# EasyEDA Pro project RAM.eprj, board PCB1
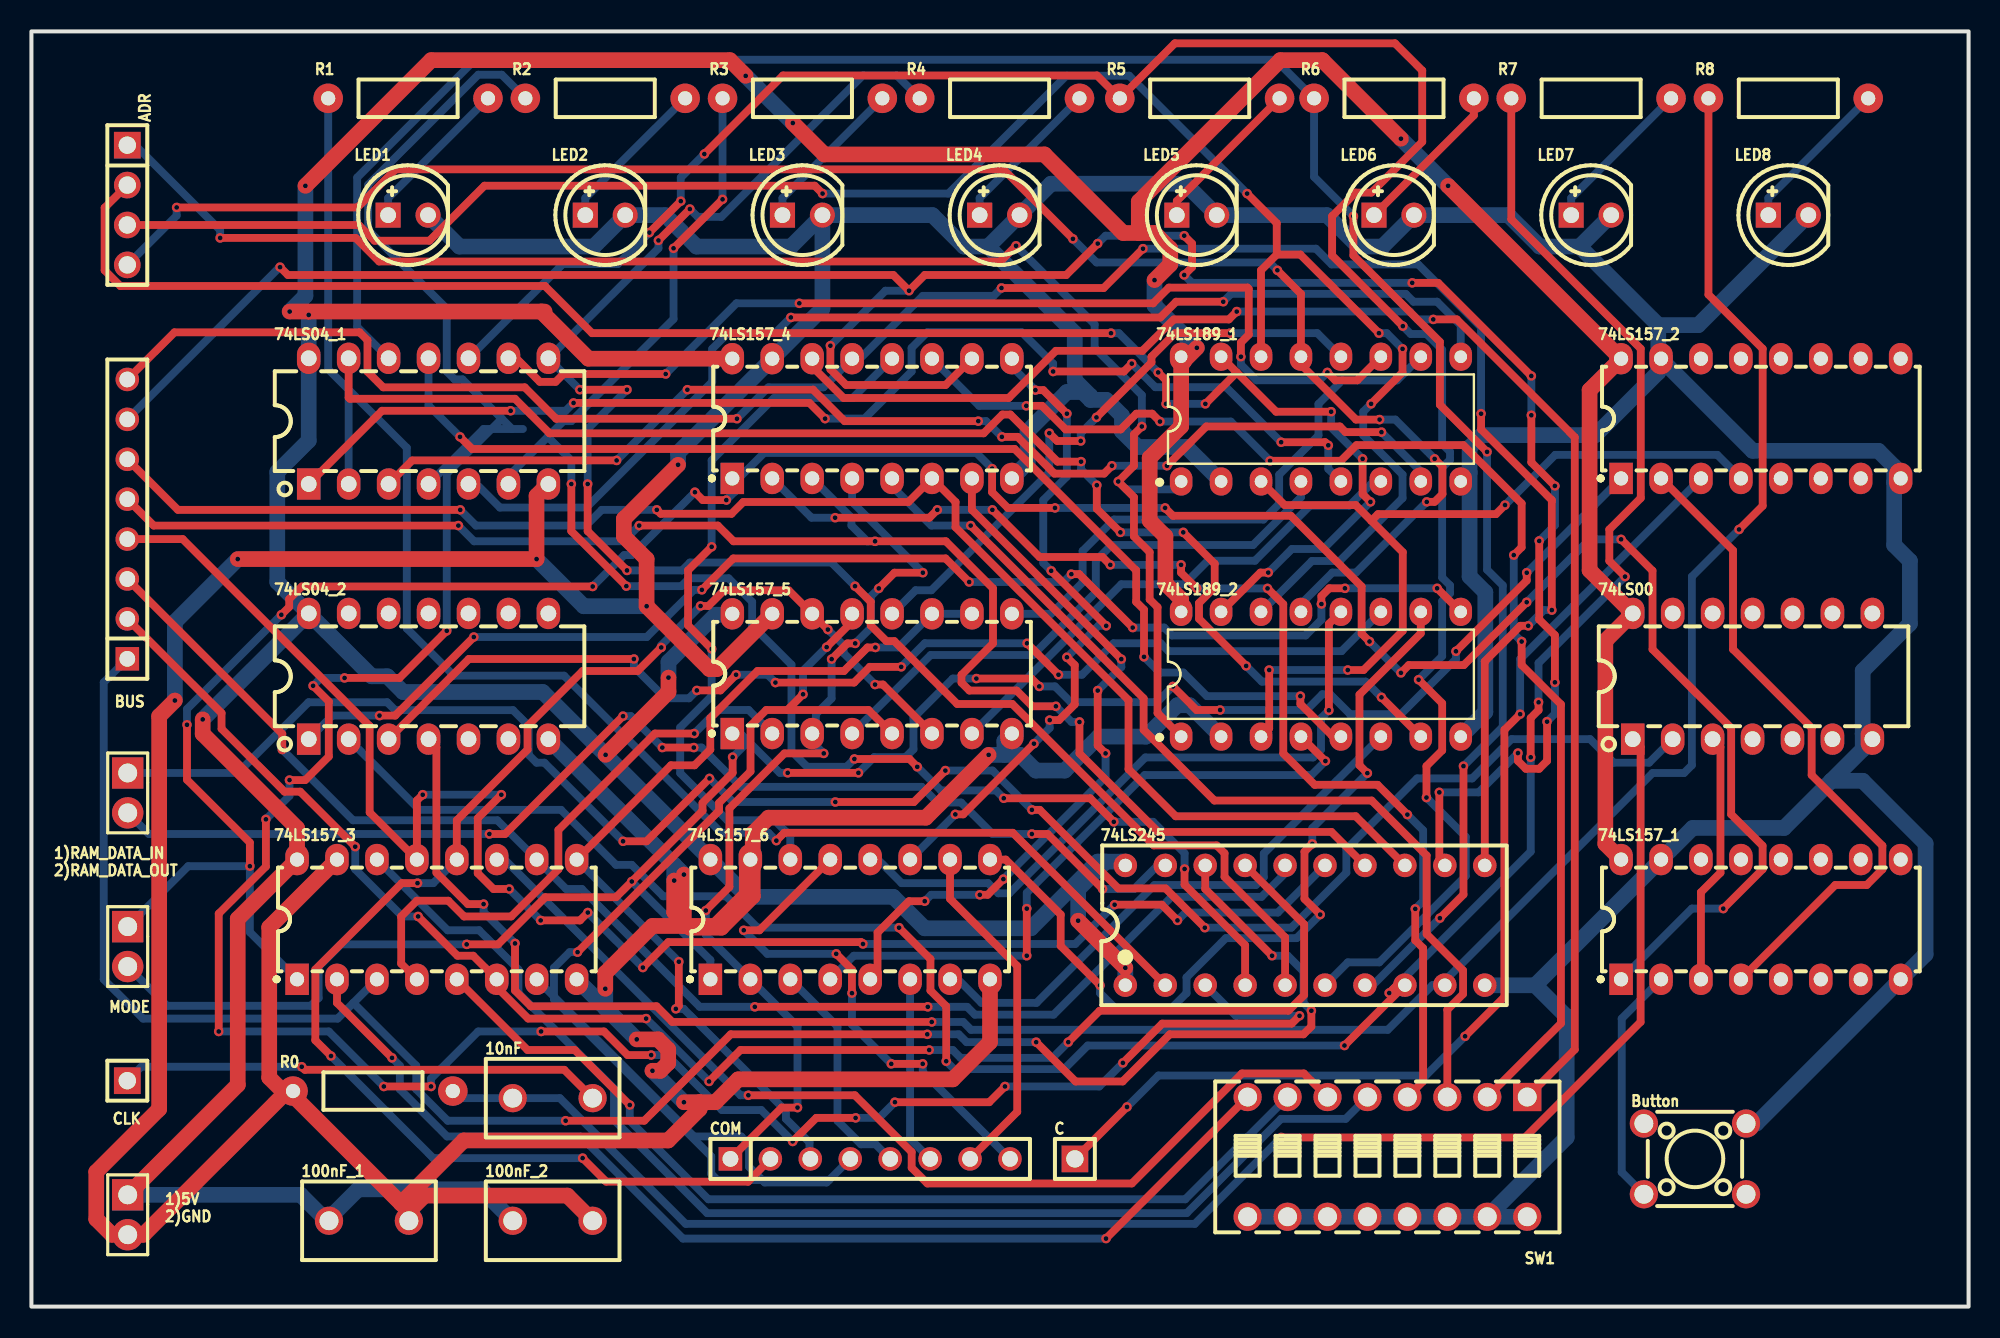
[diagram p1: board, top side]
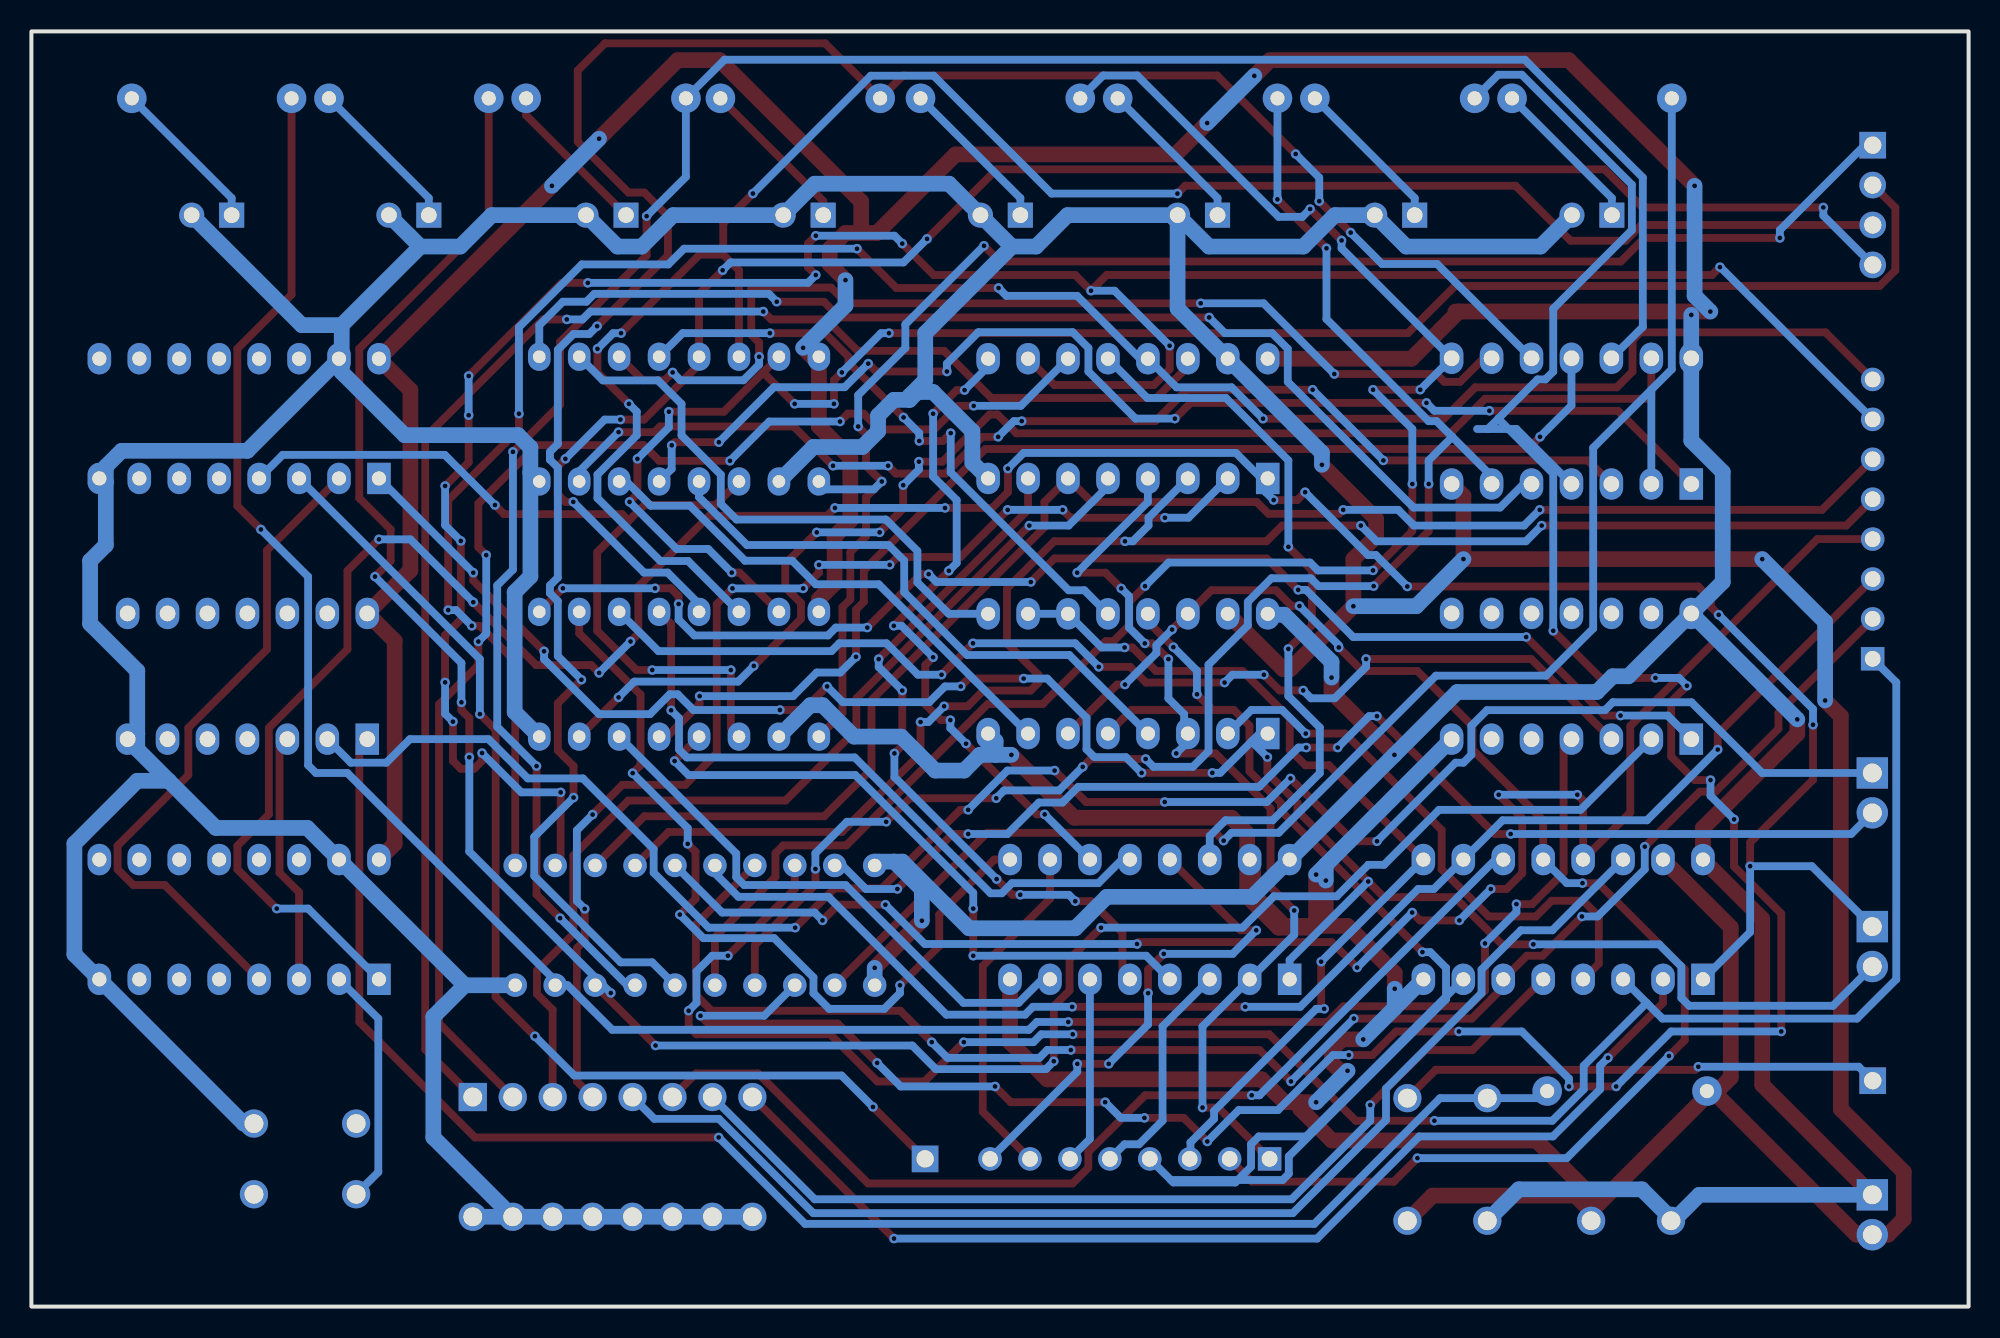
[diagram p2: board, bottom side, seen from below]

Outline 123.19 x 81.15 mm; copper layers: Top Layer, Bottom Layer. Coordinates in mm from the lower left corner of the outline.
Outline path: rectangle 0,81.15 123.19,0
Stack: Top Layer 0.035mm / Dielectric1 1.51mm FR4 er 4.5 / Bottom Layer 0.035mm

## Design rules (mm)
template: Custom Config
spacing copperThickness1oz (default): track to track 0.102, other pairs 0.152 to 0.3
spacing copperThickness2oz: track to track 0.203, other pairs 0.152 to 0.3
track width copperThickness1oz (default): min 0.127, default 0.5, max 2.54
track width copperThickness2oz: min 0.203, default 1, max 2.54
differential pair differentialPair (default): width min 0.127, default 0.254, max 2.54; gap min 0.152, default 0.152
via viaSize (default): diameter min 0.5, default 0.61, max 10; hole min 0.3, default 0.305, max 6.3
net +5V uses copperThickness2oz
net GND uses copperThickness2oz

## Placement (name value [footprint] x y rotation side)
1)5V
2)GND  -  [HDR-TH_2P-P2.54-V-M]  6.12 5.84 270 top
1)RAM_DATA_IN
2)RAM_DATA_OUT  -  [HDR-TH_2P-P2.54-V-M]  6.12 32.69 270 top
10nF  -  [CAP-TH_L8.5-W5.0-P5.00-D1.2]  33.15 13.26 0 top
74LS00  SN74LS00N  [PDIP-14_L19.7-W6.6-P2.54-LS8.3-BL]  109.45 40.11 0 top
74LS04_1  SN74LS04N  [PDIP-14_L19.7-W6.6-P2.54-LS8.3-BL]  25.25 56.35 0 top
74LS04_2  SN74LS04N  [PDIP-14_L19.7-W6.6-P2.54-LS8.3-BL]  25.25 40.11 0 top
74LS157_1  SN74LS157N  [DIP-16_16P-L20.2-W6.6-P2.54-LS7.6-BL]  109.98 24.64 0 top
74LS157_2  SN74LS157N  [DIP-16_16P-L20.2-W6.6-P2.54-LS7.6-BL]  109.98 56.52 0 top
74LS157_3  SN74LS157N  [DIP-16_16P-L20.2-W6.6-P2.54-LS7.6-BL]  25.78 24.64 0 top
74LS157_4  SN74LS157N  [DIP-16_16P-L20.2-W6.6-P2.54-LS7.6-BL]  53.46 56.52 0 top
74LS157_5  SN74LS157N  [DIP-16_16P-L20.2-W6.6-P2.54-LS7.6-BL]  53.46 40.28 0 top
74LS157_6  SN74LS157N  [DIP-16_16P-L20.2-W6.6-P2.54-LS7.6-BL]  52.07 24.64 0 top
74LS189_1  74LS189  [PDIP-16_L19.3-W6.4-P2.54-LS7.94-BL]  82 56.48 0 top
74LS189_2  74LS189  [PDIP-16_L19.3-W6.4-P2.54-LS7.94-BL]  82 40.24 0 top
74LS245  SN74LS245N  [DIP-20_L25.5-W10.0-P2.54-LS7.6-BL]  80.99 24.27 0 top
100nF_1  -  [CAP-TH_L8.5-W5.0-P5.00-D1.2]  21.46 5.46 0 top
100nF_2  -  [CAP-TH_L8.5-W5.0-P5.00-D1.2]  33.15 5.46 0 top
ADR  PZ254V-11-04P  [HDR-TH_4P-P2.54-V-M]  6.1 70.1 270 top
BUS  PZ254V-11-08P  [HDR-TH_8P-P2.54-V-M]  6.1 50.11 90 top
Button  -  [SW-TH_4P-L6.0-W6.0-P4.50-LS6.5]  105.79 9.4 0 top
C  PZ254V-11-01P  [HDR-TH_1P-P2.54-V-M]  66.36 9.4 0 top
CLK  -  [HDR-TH_1P-P2.54-V-M]  6.1 14.38 0 top
COM  PZ254V-11-08P  [HDR-TH_8P-P2.54-V-M]  53.34 9.4 0 top
LED1  -  [LED-TH_BD5.8-P2.54-FD]  23.95 69.46 0 top
LED2  -  [LED-TH_BD5.8-P2.54-FD]  36.49 69.46 0 top
LED3  -  [LED-TH_BD5.8-P2.54-FD]  49.03 69.46 0 top
LED4  -  [LED-TH_BD5.8-P2.54-FD]  61.57 69.46 0 top
LED5  -  [LED-TH_BD5.8-P2.54-FD]  74.11 69.46 0 top
LED6  -  [LED-TH_BD5.8-P2.54-FD]  86.65 69.46 0 top
LED7  -  [LED-TH_BD5.8-P2.54-FD]  99.19 69.46 0 top
LED8  -  [LED-TH_BD5.8-P2.54-FD]  111.73 69.46 0 top
MODE  PZ254V-11-02P  [HDR-TH_2P-P2.54-V-M]  6.12 22.91 270 top
R0  1K  [R_AXIAL-0.4]  21.72 13.72 0 top
R1  220  [R_AXIAL-0.4]  23.95 76.9 0 top
R2  220  [R_AXIAL-0.4]  36.49 76.9 0 top
R3  220  [R_AXIAL-0.4]  49.03 76.9 0 top
R4  220  [R_AXIAL-0.4]  61.57 76.9 0 top
R5  220  [R_AXIAL-0.4]  74.3 76.9 0 top
R6  220  [R_AXIAL-0.4]  86.65 76.9 0 top
R7  220  [R_AXIAL-0.4]  99.19 76.9 0 top
R8  220  [R_AXIAL-0.4]  111.73 76.9 0 top
SW1  DSWB08LHGET  [SW-TH_DSWB08LHGET]  86.23 9.53 180 top

## Footprints (pads in the part's own frame, mm; a bottom-side part is the same pattern mirrored in y, then rotated)
CAP-TH_L8.5-W5.0-P5.00-D1.2
  round 1.8 hole 1.2: 1(-2.54,0) 2(2.54,0)
DIP-16_16P-L20.2-W6.6-P2.54-LS7.6-BL
  rect 1.5x2 hole 0.9: 1(-8.89,-3.81)
  oval 1.5x2 hole 0.9: 2(-6.35,-3.81) 3(-3.81,-3.81) 4(-1.27,-3.81) 5(1.27,-3.81) 6(3.81,-3.81) 7(6.35,-3.81) 8(8.89,-3.81) 9(8.89,3.81) 10(6.35,3.81) 11(3.81,3.81) 12(1.27,3.81) 13(-1.27,3.81) 14(-3.81,3.81) 15(-6.35,3.81) 16(-8.89,3.81)
DIP-20_L25.5-W10.0-P2.54-LS7.6-BL
  round 1.5 hole 0.85: 1(-11.43,-3.81) 2(-8.89,-3.81) 3(-6.35,-3.81) 4(-3.81,-3.81) 5(-1.27,-3.81) 6(1.27,-3.81) 7(3.81,-3.81) 8(6.35,-3.81) 9(8.89,-3.81) 10(11.43,-3.81) 11(11.43,3.81) 12(8.89,3.81) 13(6.35,3.81) 14(3.81,3.81) 15(1.27,3.81) 16(-1.27,3.81) 17(-3.81,3.81) 18(-6.35,3.81) 19(-8.89,3.81) 20(-11.43,3.81)
HDR-TH_1P-P2.54-V-M
  rect 1.7x1.7 hole 1.1: 1(0,0)
HDR-TH_2P-P2.54-V-M
  rect 2x2 hole 1.2: 1(-1.27,0)
  round 2 hole 1.2: 2(1.27,0)
HDR-TH_4P-P2.54-V-M
  rect 1.7x1.7 hole 1.1: 1(-3.81,0)
  round 1.7 hole 1.1: 2(-1.27,0) 3(1.27,0) 4(3.81,0)
HDR-TH_8P-P2.54-V-M
  rect 1.5x1.5 hole 1: 1(-8.89,0)
  round 1.5 hole 1: 2(-6.35,0) 3(-3.81,0) 4(-1.27,0) 5(1.27,0) 6(3.81,0) 7(6.35,0) 8(8.89,0)
LED-TH_BD5.8-P2.54-FD
  rect 1.6x1.6 hole 1: 1(-1.27,0)
  round 1.6 hole 1: 2(1.27,0)
PDIP-14_L19.7-W6.6-P2.54-LS8.3-BL
  rect 1.5x2 hole 1: 1(-7.62,-4)
  oval 1.5x2 hole 1: 2(-5.08,-4) 3(-2.54,-4) 4(0,-4) 5(2.54,-4) 6(5.08,-4) 7(7.62,-4) 8(7.62,4) 9(5.08,4) 10(2.54,4) 11(0,4) 12(-2.54,4) 13(-5.08,4) 14(-7.62,4)
PDIP-16_L19.3-W6.4-P2.54-LS7.94-BL
  oval 1.44x1.8 hole 0.8: 1(-8.89,-3.97) 2(-6.35,-3.97) 3(-3.81,-3.97) 4(-1.27,-3.97) 5(1.27,-3.97) 6(3.81,-3.97) 7(6.35,-3.97) 8(8.89,-3.97) 9(8.89,3.97) 10(6.35,3.97) 11(3.81,3.97) 12(1.27,3.97) 13(-1.27,3.97) 14(-3.81,3.97) 15(-6.35,3.97) 16(-8.89,3.97)
R_AXIAL-0.4
  round 1.879 hole 0.899: 1(-5.08,0) 2(5.08,0)
SW-TH_4P-L6.0-W6.0-P4.50-LS6.5
  round 1.8 hole 1.2: 1(-3.25,2.25) 2(3.25,2.25) 3(-3.25,-2.25) 4(3.25,-2.25)
SW-TH_DSWB08LHGET
  rect 1.8x1.8 hole 1.2: 1(-8.89,-3.81)
  round 1.8 hole 1.2: 2(-6.35,-3.81) 3(-3.81,-3.81) 4(-1.27,-3.81) 5(1.27,-3.81) 6(3.81,-3.81) 7(6.35,-3.81) 8(8.89,-3.81) 9(-8.89,3.81) 10(-6.35,3.81) 11(-3.81,3.81) 12(-1.27,3.81) 13(1.27,3.81) 14(3.81,3.81) 15(6.35,3.81) 16(8.89,3.81)

## Nets
As in the schematic, except:
+5V: 1)5V
2)GND.1 74LS00.14 74LS04_1.14 74LS04_2.14 74LS157_1.16 74LS157_2.16 74LS157_3.16 74LS157_4.16 74LS157_5.16 74LS157_6.16 74LS189_1.16 74LS189_2.16 74LS245.1 74LS245.20 100nF_1.1 100nF_2.1
GND: 1)5V
2)GND.2 74LS00.7 74LS04_1.7 74LS04_2.7 74LS157_1.8 74LS157_1.15 74LS157_2.8 74LS157_2.15 74LS157_3.8 74LS157_3.15 74LS157_4.8 74LS157_4.15 74LS157_5.8 74LS157_5.15 74LS157_6.8 74LS157_6.15 74LS189_1.2 74LS189_1.8 74LS189_2.2 74LS189_2.8 74LS245.10 100nF_1.2 100nF_2.2 Button.2 LED1.2 LED2.2 LED3.2 LED4.2 LED5.2 LED6.2 LED7.2 LED8.2 R0.1 SW1.9 SW1.10 SW1.11 SW1.12 SW1.13 SW1.14 SW1.15 SW1.16
CLK: 10nF.2 CLK.1
RAM_DATA_IN: 1)RAM_DATA_IN
2)RAM_DATA_OUT.1 74LS00.2
RAM_DATA_OUT: 1)RAM_DATA_IN
2)RAM_DATA_OUT.2 74LS245.19
$1N2052: 10nF.1 74LS00.1 R0.2

Pads without a net: 74LS00 4 5 6 8 9 10 11 12 13; 74LS04_2 5 6 8 9 10 11 12 13; 74LS157_1 5 6 7 9 10 11 12 13 14; 74LS157_2 5 6 7 9 10 11 12 13 14; Button 1 4

## Via types
v1: diameter 0.61, hole 0.305, Top Layer to Bottom Layer, 319 vias

## Routing (per net, layer and track width the routed paths; a pad name or vN(x,y) marks a point on that pad's centre or on a via; arc(x,y) is an arc through that point)
+5V: length 386.9
  Top Layer w1: v1(71.42,65.33) 72.42,66.33 72.42,67.33 71.42,68.33 70.42,68.33 ; 73.11,60.02 73.11,56.02 71.11,54.02 71.11,50.02 72.11,49.02 72.11,46.02 73.11,45.02 74LS189_2.16 ; 73.11,60.02 74LS189_1.16 ; 73.11,60.02 v1(74.11,61.02) ; v1(48.42,75.33) 50.42,73.33 64.42,73.33 69.42,68.33 70.42,68.33 ; 70.42,68.33 70.42,70.33 79.42,79.33 82.09,79.33 v1(87.09,74.33) ; 74LS157_4.16 35.42,60.33 32.42,63.33 ; 101.09,28.45 100.09,29.45 100.09,42.37 74LS00.14 99.09,46.86 99.09,58.33 101.09,60.33 v1(90.09,71.33) ; 1)5V
2)GND.1 13.12,14.11 13.12,24.68 74LS157_3.16 16.89,30.45 10.89,36.45 v1(10.89,37.37) ; 32.42,63.33 32.63,63.33 ; 32.42,63.33 v1(16.42,63.33) ; v1(17.42,71.33) 25.42,79.33 44.42,79.33 v1(45.42,78.33) ; v1(36.51,35.11) 40.51,39.11 v1(40.51,40.03) ; v1(66.56,24.56) v1(69.56,21.56)
  Bottom Layer w1: 74LS245.20 69.32,28.32 68.32,28.32 ; v1(74.11,61.02) 71.42,63.71 v1(71.42,65.33) ; v1(17.42,71.33) 17.42,64.33 v1(16.42,63.33) ; v1(45.42,78.33) v1(48.42,75.33) ; v1(10.89,37.37) 74LS04_2.14 ; 74LS04_2.14 21.63,40.11 22.63,40.11 23.63,39.11 32.51,39.11 v1(36.51,35.11) 74LS157_6.16 45.55,26.08 54.81,26.08 56.81,24.08 63.56,24.08 67.81,28.32 68.32,28.32 ; 74LS04_2.14 15.63,46.11 15.63,53.11 17.63,55.11 74LS04_1.14 v1(17.63,63.11) ; 18.77,5.46 20.77,7.46 28.61,7.46 100nF_2.1 ; 18.77,5.46 17.12,7.11 1)5V
2)GND.1 ; 18.77,5.46 100nF_1.1 ; 68.32,28.32 66.56,26.56 v1(66.56,24.56) ; 74LS157_5.16 44.51,44.03 43.51,44.03 40.51,41.03 v1(40.51,40.03) ; v1(87.09,74.33) v1(90.09,71.33) ; v1(69.56,21.56) 74LS245.1
GND: length 627.3
  Top Layer w1: 41.49,24.22 39.49,24.22 36.49,21.22 v1(36.49,20.22) ; 41.49,24.22 41.49,24.49 ; 41.49,24.22 41.76,24.22 ; 16.49,13.57 23.49,6.57 ; 16.49,13.57 16.12,13.57 ; 16.49,13.57 R0.1 ; 23.49,6.57 24,6.06 ; 23.49,6.57 27.49,10.57 40.49,10.57 42.49,12.57 42.49,13.01 ; v1(39.49,15.01) 39.99,15.01 40.49,15.51 40.49,16.36 39.85,17.01 v1(38.49,17.01) ; 42.49,13.01 43.49,13.01 44.95,14.46 58.59,14.46 60.96,16.83 74LS157_6.8 ; 42.49,13.01 v1(41.49,13.01) ; 74LS157_5.15 43.59,40.57 43.12,40.57 v1(39.12,44.57) 39.12,47.57 37.68,49.02 37.68,50.13 v1(41.12,53.57) ; v1(13.12,47.57) v1(32.12,47.57) 32.12,51.6 74LS04_1.7 ; 16.12,13.57 7.12,4.57 1)5V
2)GND.2 5.12,4.57 4.12,5.57 4.12,8.57 8.12,12.57 8.12,37.57 v1(9.12,38.57) ; 16.12,13.57 15.12,14.57 15.12,24.14 74LS157_3.15 ; 24,6.06 100nF_1.2 ; 24,6.06 25,7.06 34.09,7.06 100nF_2.2 ; 41.49,24.49 v1(41.49,27.49) ; 41.49,24.49 41.76,24.22 ; 41.49,24.49 40.87,25.11 v1(40.87,27.11) ; 41.76,24.22 41.87,24.11 43.87,24.11 45.87,26.11 45.87,30.11 46.87,31.11 56.87,31.11 v1(60.87,35.11) ; 41.76,24.22 43.49,24.22 45.49,26.22 45.49,28.22 74LS157_6.15
  Bottom Layer w1: 74LS189_1.2 73.46,54.7 70.35,54.7 69.35,55.7 69.35,56.7 68.35,57.7 67.35,57.7 ; LED3.2 48.3,67.46 42.3,67.46 40.3,69.46 LED2.2 35.76,67.46 27.22,67.46 LED1.2 ; LED3.2 57.3,69.46 59.3,67.46 60.84,67.46 ; LED3.2 50.3,63.52 74LS157_4.15 41.12,54.34 v1(41.12,53.57) ; 60.84,67.46 66.35,61.95 66.35,58.95 67.35,57.95 67.35,57.7 ; 60.84,67.46 64.84,71.46 73.38,71.46 LED5.2 82.38,69.46 84.38,67.46 85.92,67.46 LED6.2 93.92,69.46 95.92,67.46 98.46,67.46 ; 91.46,53.08 74LS189_1.8 ; 91.46,53.08 91.46,46.46 92.46,45.46 92.46,37.84 74LS189_2.8 ; 91.46,53.08 91.46,54.68 92.24,55.46 99.46,55.46 103.46,59.46 103.46,60.46 ; 67.35,57.7 66.85,58.2 65.85,58.2 63.35,55.7 63.35,53.7 74LS157_4.8 ; 40.87,28.11 74LS04_2.7 ; 40.87,28.11 v1(41.49,27.49) ; 40.87,28.11 v1(40.87,27.11) ; 103.46,60.46 109.46,54.46 117.46,54.46 118.46,53.46 118.46,52.46 ; 103.46,60.46 103.63,60.33 ; 103.46,60.46 103.46,62.46 ; 98.46,67.46 103.46,62.46 ; 98.46,67.46 LED7.2 ; 114.46,33.46 116.46,35.46 116.46,36.46 ; 114.46,33.46 111.46,30.46 105.64,30.46 95.63,20.45 ; 114.46,33.46 116.46,33.46 120.46,29.46 120.46,22.42 74LS157_1.8 109.69,11.65 Button.2 ; 74LS189_2.2 73.65,38.27 72.87,38.27 70.87,36.27 67.87,36.27 65.71,34.11 63.87,34.11 62.87,35.11 61.87,35.11 ; v1(41.49,13.01) v1(39.49,15.01) ; SW1.16 SW1.15 SW1.14 SW1.13 SW1.12 SW1.11 SW1.10 ; 74LS157_5.8 61.87,35.99 61.87,35.11 ; v1(32.12,47.57) 35.12,44.57 v1(39.12,44.57) ; 116.46,36.46 116.73,36.46 74LS00.7 ; 116.46,36.46 116.46,40.46 119.46,43.46 119.46,47.46 118.46,48.46 118.46,52.46 ; 118.46,52.46 118.63,52.46 74LS157_2.8 ; v1(38.49,17.01) 36.49,19.01 ; 36.49,19.01 74LS157_3.8 ; 36.49,19.01 v1(36.49,20.22) ; 95.63,20.45 92.43,20.45 74LS245.10 ; 95.63,20.45 97.63,18.45 97.63,10.76 SW1.10 ; v1(9.12,38.57) 9.12,43.57 v1(13.12,47.57) ; 103.46,62.46 106,62.46 LED8.2 ; SW1.10 SW1.9 ; v1(60.87,35.11) 61.87,35.11
A0: length 101.5
  Top Layer w0.5: v1(12,68.01) 20.61,68.01 22.11,66.51 61.61,66.51 v1(62.61,67.51) ; 74LS189_2.1 71.61,37.77 71.61,44.51 71.11,45.01 71.11,48.01 70.11,49.01 70.11,51.51 v1(69.11,52.51) 70.11,53.51 70.11,55.51 v1(70.61,56.01)
  Bottom Layer w0.5: 74LS189_1.1 72.61,52.01 69.61,52.01 v1(69.11,52.51) ; v1(70.61,56.01) 70.61,58.01 67.61,61.01 67.61,62.51 v1(62.61,67.51) ; ADR.1 6.6,73.91 12,68.51 v1(12,68.01)
A1: length 110.9
  Top Layer w0.5: 74LS189_1.15 76.65,59.45 ; 76.65,59.45 v1(74.65,57.45) ; 76.65,59.45 79.15,56.95 v1(82.65,56.95) ; 74LS189_2.15 78.15,46.71 v1(78.65,46.71) ; ADR.2 4.65,69.93 4.65,65.95 5.65,64.95 32.65,64.95 35.65,61.95 v1(68.65,61.95) ; v1(84.65,53.95) 84.65,51.71 v1(85.15,51.21) ; v1(71.65,59.45) 72.15,58.95 v1(72.15,57.45)
  Bottom Layer w0.5: v1(74.65,57.45) v1(72.15,57.45) ; v1(71.65,59.45) 69.15,61.95 v1(68.65,61.95) ; v1(78.65,46.71) 80.15,48.21 82.15,48.21 v1(85.15,51.21) ; v1(82.65,56.95) 82.65,55.95 v1(84.65,53.95)
A2: length 125.1
  Top Layer w0.5: 74LS189_1.14 78.19,65.95 79.19,66.95 ; v1(85.69,61.95) 80.69,66.95 79.19,66.95 ; 79.19,66.95 79.19,68.95 v1(77.31,70.83) ; ADR.3 20.81,68.83 21.81,67.83 25.31,67.83 28.81,71.33 49.81,71.33 v1(50.31,70.83) ; v1(87.19,60.95) 87.19,59.45 v1(85.19,57.45)
  Bottom Layer w0.5: v1(85.69,61.95) 86.19,61.95 v1(87.19,60.95) ; v1(50.31,70.83) 58.31,70.83 65.81,78.33 69.81,78.33 v1(77.31,70.83) ; v1(85.19,57.45) 84.69,56.95 84.69,55.45 87.19,52.95 87.19,51.45 83.19,47.45 81.43,47.45 74LS189_2.14
A3: length 111.1
  Top Layer w0.5: v1(89.23,53.95) 89.73,53.45 89.73,51.71 89.23,51.21 v1(88.73,51.21) ; v1(66.23,67.95) 61.81,72.37 23.16,72.37 20.73,69.95 v1(9.23,69.95) ; v1(79.23,65.95) 80.73,64.45 74LS189_1.13 80.73,59.95 84.23,56.45 v1(85.73,56.45)
  Bottom Layer w0.5: 74LS189_2.13 80.73,44.71 82.73,46.71 84.23,46.71 v1(88.73,51.21) ; v1(89.23,53.95) 86.73,56.45 v1(85.73,56.45) ; v1(79.23,65.95) 78.73,66.45 67.73,66.45 v1(66.23,67.95) ; v1(9.23,69.95) 9.23,69.43 ADR.4
BUS_1: length 124
  Top Layer w0.5: v1(56.97,17.33) 44.47,17.33 38.97,11.83 v1(33.97,11.83) ; v1(63.9,16.83) 66.4,14.33 69.4,14.33 72.4,17.33 80.9,17.33 81.4,17.83 v1(81.4,18.83) ; v1(78.9,22.33) 74.64,26.58 74LS245.18
  Bottom Layer w0.5: BUS.1 4.6,39.72 4.6,20.83 7.1,18.33 19.47,18.33 20.47,19.33 ; v1(78.9,22.33) 79.9,22.33 80.9,21.33 80.9,19.33 v1(81.4,18.83) ; v1(63.9,16.83) 59.47,16.83 58.97,17.33 v1(56.97,17.33) ; v1(33.97,11.83) 26.47,11.83 24.47,13.83 24.47,15.33 20.47,19.33 ; 20.47,19.33 74LS157_3.3
BUS_2: length 101.3
  Top Layer w0.5: v1(20.59,29.27) 17.09,32.77 16.09,32.77 12.09,36.77 12.09,37.77 BUS.2 ; v1(39.09,18.33) 31.59,18.33 29.59,20.33 74LS157_3.6 28.09,22.33 27.09,22.33 v1(24.59,24.83) ; v1(57.09,16.33) 45.09,16.33 v1(43.09,14.33) ; 74LS245.17 80.94,24.33 80.94,19.83 79.94,18.83 67.94,18.83 v1(65.94,16.83)
  Bottom Layer w0.5: v1(24.59,24.83) 23.59,24.83 20.59,27.83 v1(20.59,29.27) ; v1(39.09,18.33) v1(43.09,14.33) ; v1(57.09,16.33) 58.59,16.33 59.09,15.83 64.94,15.83 v1(65.94,16.83)
BUS_3: length 89.9
  Top Layer w0.5: BUS.3 15.95,36.45 v1(15.95,35.45) ; v1(46,19.08) v1(57,19.08)
  Bottom Layer w0.5: 74LS245.16 79.72,27.58 78.22,26.08 72.5,26.08 65,18.58 60,18.58 59.5,19.08 v1(57,19.08) ; v1(46,19.08) 42.5,19.08 35,26.58 34,26.58 74LS157_3.10 29.63,30.95 20.45,30.95 v1(15.95,35.45)
BUS_4: length 105.4
  Top Layer w0.5: v1(38.88,21.58) 40.5,23.2 52.76,23.2 v1(52.88,23.08) ; v1(72.88,24.58) 71.88,25.58 v1(68.88,25.58) ; v1(32.38,24.58) 34.88,24.58 v1(35.38,25.08) ; v1(29.88,32.58) 28.38,31.08 28.38,27.58 29.38,26.58 v1(30.38,26.58) ; BUS.4 9.62,48.84 21.51,36.95 21.51,31.45 74LS157_3.13 24.51,32.2 v1(24.88,32.58)
  Bottom Layer w0.5: v1(52.88,23.08) 66.38,23.08 v1(68.88,25.58) ; 74LS245.15 79.26,25.08 73.38,25.08 v1(72.88,24.58) ; v1(24.88,32.58) v1(29.88,32.58) ; v1(30.38,26.58) v1(32.38,24.58) ; v1(35.38,25.08) v1(38.88,21.58)
BUS_5: length 102.7
  Top Layer w0.5: BUS.5 7.78,49.7 v1(27.15,49.7) ; v1(65.15,38.2) 63.65,38.2 62.65,39.2 59.65,39.2 59.15,39.7 59.15,40.2 61.15,42.2 61.15,45.7 58.15,48.7 v1(53.65,48.7) 44.65,48.7 43.65,49.7 v1(38.65,49.7) ; v1(66.65,37.2) 66.65,35.2 71.65,30.2 82.68,30.2 74LS245.14
  Bottom Layer w0.5: v1(53.65,48.7) 53.15,48.7 52.15,49.7 52.15,50.2 74LS157_4.3 ; v1(27.15,49.7) 28.15,48.7 37.65,48.7 v1(38.65,49.7) ; v1(66.65,37.2) 66.15,37.2 v1(65.15,38.2)
BUS_6: length 98.2
  Top Layer w0.5: v1(39.77,50.7) 40.02,50.45 44.52,50.45 45.27,51.2 55.77,51.2 74LS157_4.6 58.77,51.2 58.77,49.6 69.77,38.6 69.77,34.2 72.77,31.2 84.22,31.2 74LS245.13 ; v1(27.27,50.7) 9.31,50.7 BUS.6
  Bottom Layer w0.5: v1(39.77,50.7) 36.27,50.7 35.27,49.7 28.27,49.7 v1(27.27,50.7)
BUS_7: length 158.8
  Top Layer w0.5: 74LS157_4.10 58.14,58.65 51.81,58.65 50.81,59.65 v1(50.81,61.15) ; v1(96.38,37.23) 96.38,34.73 95.88,34.23 95.03,34.23 94.53,34.73 v1(94.53,35.23) ; v1(95.38,56.73) 95.38,53.73 v1(96.88,52.23) ; v1(67.81,67.65) 65.81,65.65 56.81,65.65 v1(55.81,64.65) 54.81,65.65 16.31,65.65 v1(15.81,66.15) ; v1(87.81,65.15) 89.46,65.15 v1(95.38,59.23) ; v1(73.31,68.15) 73.81,67.65 73.81,66.15 v1(73.31,65.65) ; v1(96.88,39.73) 96.88,42.73 95.88,43.73 v1(95.88,48.73) ; v1(89.53,32.73) 89.53,28.43 74LS245.12
  Bottom Layer w0.5: v1(50.81,61.15) 54.31,64.65 v1(55.81,64.65) ; v1(87.81,65.15) 73.81,65.15 v1(73.31,65.65) ; v1(95.88,48.73) 96.88,49.73 v1(96.88,52.23) ; v1(96.88,39.73) 96.88,37.73 v1(96.38,37.23) ; v1(89.53,32.73) 92.03,32.73 v1(94.53,35.23) ; v1(67.81,67.65) 68.31,68.15 v1(73.31,68.15) ; v1(95.38,59.23) v1(95.38,56.73) ; v1(15.81,66.15) 15.78,66.15 BUS.7
BUS_8: length 135.8
  Top Layer w0.5: BUS.8 9.1,62 20.87,62 21.37,61.5 21.37,59.5 22.37,58.5 31.37,58.5 33.37,56.5 v1(44.87,56.5) ; 74LS245.11 92.42,41.06 94.69,43.33 v1(95.19,43.33) ; v1(61.69,64.83) 68.19,64.83 v1(70.69,67.33) ; v1(96.69,44.33) 96.69,51.33 92.19,55.83 v1(92.19,56.83)
  Bottom Layer w0.5: v1(95.19,43.33) 96.19,44.33 v1(96.69,44.33) ; v1(61.69,64.83) 61.19,64.33 56.69,64.33 52.69,60.33 74LS157_4.13 50.37,58.5 46.87,58.5 v1(44.87,56.5) ; v1(92.19,56.83) 92.19,62.33 88.19,66.33 82.69,66.33 81.69,67.33 v1(70.69,67.33)
C: length 69.8
  Top Layer w0.5: v1(69.67,12.71) C.1 ; v1(91.17,17.21) 93.67,19.71 93.67,36.7 v1(94.67,37.7)
  Bottom Layer w0.5: 74LS157_2.3 94.67,41.2 v1(94.67,37.7) ; v1(91.17,17.21) 88.67,14.71 71.67,14.71 v1(69.67,12.71)
C_1: length 59.2
  Top Layer w0.5: v1(52.39,42.2) 51.89,42.2 v1(50.89,41.2) ; v1(56.69,46.7) 54.89,46.7 v1(53.89,45.7) ; v1(42.89,25.2) 44.39,26.7 44.39,31.7 47.89,35.2 v1(50.39,35.2) ; 44.45,9.4 47.72,12.66 v1(48.72,12.66)
  Bottom Layer w0.5: 49.89,36.7 49.89,35.7 v1(50.39,35.2) ; 49.89,36.7 74LS157_5.3 ; 49.89,36.7 49.89,37.7 50.89,38.7 v1(50.89,41.2) ; v1(48.72,12.66) 48.72,17.83 74LS157_6.2 42.89,23.66 v1(42.89,25.2) ; v1(52.39,42.2) 53.39,43.2 53.39,45.2 v1(53.89,45.7) ; 74LS157_4.4 52.19,51.2 v1(56.69,46.7)
C_2: length 93.5
  Top Layer w0.5: v1(19.05,15.95) 18.05,16.95 18.05,21.45 23.55,26.95 v1(24.55,26.95) ; v1(50.65,43.09) 74LS157_5.14 48.15,45.59 44.05,45.59 43.05,44.59 v1(42.55,44.59) ; 74LS157_3.12 27.05,30.95 31.55,35.45 31.55,36.95 35.05,40.45 38.55,40.45 v1(40.05,41.95) ; v1(53.65,39.59) 54.15,39.59 74LS157_5.6 ; COM.2 45.58,7.95 36.55,7.95 v1(35.05,9.45)
  Bottom Layer w0.5: v1(40.05,41.95) 40.05,42.09 v1(42.55,44.59) ; v1(24.55,26.95) 25.55,26.95 74LS157_3.12 ; v1(50.65,43.09) 51.65,42.09 51.65,41.59 v1(53.65,39.59) ; v1(35.05,9.45) 25.55,9.45 v1(19.05,15.95)
C_3: length 58.4
  Top Layer w0.5: 74LS157_3.9 40.67,34.45 42.17,34.45 43.17,35.45 43.17,37.45 46.17,40.45 51.67,40.45 53.17,41.95 v1(53.67,41.95) ; v1(41.17,21.95) 41.17,19.14 v1(40.98,18.95)
  Bottom Layer w0.5: 49.53,9.4 49.48,9.45 49.48,10.45 47.98,11.95 47.98,12.45 41.48,18.95 v1(40.98,18.95) ; v1(53.67,41.95) 55.13,41.95 74LS157_5.11 74LS157_5.10 ; 74LS157_3.9 v1(41.17,21.95)
C_4: length 90.4
  Top Layer w0.5: 48.07,37.97 53.23,37.97 74LS157_5.5 ; 48.07,37.97 v1(49.07,38.97) ; 48.07,37.97 46.73,37.97 45.73,36.97 45.73,34.06 43.73,32.06 43.73,31.56 v1(34.73,22.56) ; v1(50.57,41.97) 52.19,43.59 74LS157_5.13
  Bottom Layer w0.5: 46.47,8.06 46.63,7.9 50.57,7.9 50.73,8.06 ; 46.47,8.06 45.63,8.9 45.63,10.33 45.13,10.83 42.13,10.83 33.23,19.73 ; 46.47,8.06 43.62,8.06 43.23,8.45 43.23,9.56 33.23,19.56 33.23,19.73 ; 46.47,8.06 50.73,8.06 ; 74LS157_3.7 33.23,19.73 ; 33.23,19.73 33.23,21.56 34.23,22.56 v1(34.73,22.56) ; 50.73,8.06 52.07,9.4 ; v1(49.07,38.97) 49.07,40.47 v1(50.57,41.97)
C_5: length 14.6
  Bottom Layer w0.5: COM.5 53.68,10.33 52.76,10.33 51.26,11.83 51.26,17.83 74LS157_6.3
C_6: length 12
  Bottom Layer w0.5: 74LS157_6.6 55.88,10.67 COM.6
C_7: length 22.1
  Top Layer w0.5: 59.69,9.4 62.69,12.4 62.69,21.68 58.42,25.95 74LS157_6.10
C_8: length 32.7
  Top Layer w0.5: v1(51.18,22.45) 52.18,21.45 v1(52.18,19.95) ; v1(54.68,15.45) v1(56.68,15.45) ; v1(45.3,23.95) 46.3,23.95 74LS157_6.13
  Bottom Layer w0.5: v1(51.18,22.45) 46.8,22.45 v1(45.3,23.95) ; COM.8 56.68,14.95 v1(56.68,15.45) ; v1(52.18,19.95) 52.18,17.95 v1(54.68,15.45)
CLK: length 30.8
  Top Layer w0.5: 10nF.2 33.88,15.07 17.38,15.07 v1(17.19,15.26)
  Bottom Layer w0.5: v1(17.19,15.26) 6.98,15.26 CLK.1
DIP_1: length 70.2
  Top Layer w0.5: v1(68.34,4.33) SW1.8 ; 74LS157_3.2 19.43,19.33 v1(22.93,15.83)
  Bottom Layer w0.5: v1(22.93,15.83) 23.43,15.33 23.43,13.83 26.43,10.83 34.93,10.83 41.43,4.33 v1(68.34,4.33)
DIP_2: length 61.9
  Top Layer w0.5: v1(38.05,12.83) 34.55,16.33 31.55,16.33 74LS157_3.5
  Bottom Layer w0.5: v1(38.05,12.83) 38.05,11.83 43.05,6.83 73.38,6.83 SW1.7
DIP_3: length 65.5
  Top Layer w0.5: SW1.6 80.92,14.84 76.98,14.84 69.98,7.84 56.98,7.84 55.98,8.84 55.98,9.84 52.36,13.45 v1(45.59,13.45)
  Bottom Layer w0.5: 74LS157_3.11 30.09,28.45 45.09,13.45 v1(45.59,13.45)
DIP_4: length 77.4
  Bottom Layer w0.5: SW1.5 83.58,11.95 79.47,11.95 73.47,5.95 42.97,5.95 37.05,11.87 37.05,13.87 30.97,19.95 30.97,21.45 28.47,23.95 26.47,23.95 74LS157_3.14
DIP_5: length 74.7
  Top Layer w0.5: v1(78.61,45.7) 79.61,44.7 79.61,35.2 81.61,33.2 85.61,33.2 v1(87.5,31.31) ; v1(57.61,50.7) 57.11,50.2 v1(51.11,50.2) ; v1(61.11,50.7) 64.11,47.7 68.11,47.7 v1(68.61,47.2) ; v1(74.11,45.7) 73.11,46.7 v1(73.11,47.2) ; v1(88,25.31) 88,23.31 88.5,22.81 88.5,14.34 SW1.4
  Bottom Layer w0.5: v1(51.11,50.2) 49.61,50.2 74LS157_4.2 ; v1(68.61,47.2) v1(73.11,47.2) ; v1(88,25.31) 88.5,25.81 88.5,30.31 v1(87.5,31.31) ; v1(57.61,50.7) v1(61.11,50.7) ; v1(74.11,45.7) v1(78.61,45.7)
DIP_6: length 62.1
  Top Layer w0.5: SW1.3 90.04,18.89 91.04,19.89 91.04,21.39 88.73,23.7 88.73,28.7 85.23,32.2 75.23,32.2 70.73,36.7 70.73,38.7 v1(59.73,49.7)
  Bottom Layer w0.5: 74LS157_4.5 54.73,52.2 57.23,49.7 v1(59.73,49.7)
DIP_7: length 84.1
  Top Layer w0.5: v1(94.27,47.83) 94.77,48.33 94.77,51.11 91.05,54.83 84.27,54.83 83.27,53.83 v1(78.77,53.83) ; SW1.2 97.27,18.02 97.27,38.33 94.77,40.83 v1(94.77,42.33) ; v1(63.27,57.33) 64.27,57.33 65.77,55.83 69.27,55.83 70.27,56.83 71.27,56.83 v1(71.77,56.33)
  Bottom Layer w0.5: v1(94.27,47.83) 94.27,42.83 v1(94.77,42.33) ; 74LS157_4.11 60.27,57.33 v1(63.27,57.33) ; v1(78.77,53.83) 76.27,56.33 v1(71.77,56.33)
DIP_8: length 98.7
  Top Layer w0.5: v1(76.65,63.33) 76.15,62.83 72.65,62.83 70.65,60.83 65.15,60.83 62.15,57.83 51.65,57.83 49.65,59.83 74LS157_4.14 ; v1(89.15,62.83) 90.65,62.83 98.15,55.33 98.15,16.36 SW1.1
  Bottom Layer w0.5: v1(76.65,63.33) 87.65,63.33 88.15,62.83 v1(89.15,62.83)
MODE_1: length 177.5
  Top Layer w0.5: v1(65.09,50.83) 62.09,50.83 61.09,51.83 v1(61.09,53.33) ; v1(95.09,44.83) 91.09,40.83 87.59,40.83 v1(87.09,40.33) ; v1(35.69,45.83) 17.19,45.83 16.39,45.03 16.39,44.53 v1(15.89,44.03) ; v1(9.89,37.03) 9.89,33.53 13.89,29.53 v1(13.89,28.03) ; v1(85.09,42.33) 84.59,42.83 84.59,45.83 80.09,50.33 72.59,50.33 v1(72.09,50.83) ; v1(44.19,51.33) 42.69,51.33 v1(42.19,51.83) ; v1(101.09,48.83) 103.09,46.83 103.09,41.83 108.09,36.83 108.09,31.33 110.09,29.33 110.09,27.83 v1(107.59,25.33)
  Bottom Layer w0.5: v1(15.89,44.03) 9.89,38.03 v1(9.89,37.03) ; v1(95.09,44.83) 99.09,48.83 v1(101.09,48.83) ; v1(107.59,25.33) 105.59,25.33 101.09,20.83 ; v1(44.19,51.33) 44.69,51.83 44.69,52.83 ; v1(72.09,50.83) v1(65.09,50.83) ; 74LS157_3.1 13.89,23.83 v1(13.89,28.03) 9.97,28.03 MODE.1 ; 44.69,52.83 74LS157_4.1 ; 44.69,52.83 45.09,52.83 46.59,54.33 60.09,54.33 v1(61.09,53.33) ; v1(42.19,51.83) 38.19,47.83 37.69,47.83 v1(35.69,45.83) ; v1(87.09,40.33) v1(85.09,42.33)
MODE_2: length 128.4
  Top Layer w0.5: v1(27.68,23.05) 29.68,23.05 32.68,26.05 37.18,26.05 v1(38.18,27.05) 42.68,31.55 42.68,32.05 44.59,33.97 v1(44.59,34.97) ; v1(95.09,46.7) 95.09,46.2 v1(90.59,41.7) ; v1(60.09,39.97) 63.59,39.97 v1(64.09,39.47) ; v1(52.59,33.97) v1(48.09,33.97) ; v1(72.59,39.47) 74.09,37.97 v1(75.59,37.97)
  Bottom Layer w0.5: 74LS157_5.1 45.09,36.47 45.59,35.97 ; 74LS157_6.1 43.18,22.05 v1(38.18,27.05) ; v1(64.09,39.47) 65.09,39.47 66.09,38.47 71.59,38.47 v1(72.59,39.47) ; MODE.2 8.62,19.14 17.77,19.14 18.27,19.64 18.27,21.64 19.68,23.05 v1(27.68,23.05) ; 101.09,52.7 v1(95.09,46.7) ; 45.59,35.97 47.59,33.97 v1(48.09,33.97) ; 45.59,35.97 v1(44.59,34.97) ; v1(52.59,33.97) 53.59,34.97 55.59,34.97 56.09,35.47 56.09,37.47 58.59,39.97 v1(60.09,39.97) ; v1(75.59,37.97) 81.09,37.97 82.09,38.97 82.59,38.97 83.86,37.7 87.09,37.7 90.59,41.2 v1(90.59,41.7)
RAM_DATA_IN: length 119.2
  Top Layer w0.5: v1(74.62,24.11) 72.12,26.61 69.12,26.61 64.12,31.61 v1(63.62,31.61) ; v1(51.12,32.11) 56.12,32.11 v1(58.12,34.11) ; v1(43.12,33.61) 39.12,29.61 v1(37.62,29.61)
  Bottom Layer w0.5: v1(37.62,29.61) 32.62,34.61 32.12,34.61 31.62,35.11 31.62,36.96 30.62,37.96 23.12,37.96 22.62,38.46 17.62,38.46 13.12,33.96 1)RAM_DATA_IN
2)RAM_DATA_OUT.1 ; v1(63.62,31.61) 61.12,34.11 v1(58.12,34.11) ; v1(43.12,33.61) 44.62,32.11 v1(51.12,32.11) ; v1(74.62,24.11) 80.12,24.11 83.62,27.61 83.62,29.11 88.12,33.61 91.62,33.61 94.12,36.11 99.12,36.11 100.62,34.61 102.87,34.61 74LS00.2
RAM_DATA_OUT: length 74.8
  Top Layer w0.5: v1(63.62,30.08) 64.62,30.08 v1(68.12,26.58) ; v1(37.62,37.58) 30.12,30.08 v1(29.12,30.08) ; v1(40.12,35.58) v1(42.12,35.58)
  Bottom Layer w0.5: v1(42.12,35.58) 42.62,35.58 45.12,33.08 56.62,33.08 57.62,32.08 59.12,32.08 61.12,30.08 v1(63.62,30.08) ; 74LS245.19 71.62,28.08 70.12,26.58 v1(68.12,26.58) ; v1(40.12,35.58) 38.12,37.58 v1(37.62,37.58) ; 1)RAM_DATA_IN
2)RAM_DATA_OUT.2 7.47,30.08 v1(29.12,30.08)
$1N1972: length 76.9
  Top Layer w0.5: v1(30.47,57.01) 22.29,57.01 74LS04_1.1 ; v1(34.47,57.51) 49.47,57.51 v1(50.47,56.51) ; v1(69.97,60.01) 69.47,59.51 v1(64.97,59.51) ; v1(82.47,54.81) 82.27,55.01 v1(79.47,55.01)
  Bottom Layer w0.5: v1(64.97,59.51) 64.97,60.01 62.97,62.01 56.97,62.01 55.97,61.01 55.97,59.51 52.97,56.51 v1(50.47,56.51) ; v1(34.47,57.51) 33.97,57.01 v1(30.47,57.01) ; v1(82.47,54.81) 82.47,53.31 74LS189_1.5 ; v1(79.47,55.01) 75.97,58.51 71.47,58.51 v1(69.97,60.01)
$1N1973: length 73.4
  Top Layer w0.5: v1(37.21,53.85) 24.21,53.85 74LS04_1.3 ; v1(41.71,58.35) 49.71,58.35 51.71,56.35 v1(60.21,56.35) ; v1(72.21,53.51) 74.71,56.01 83.21,56.01 83.57,55.65 v1(85.85,55.65) ; v1(68.71,53.51) 68.21,53.01 65.05,53.01 62.71,55.35 v1(61.71,55.35)
  Bottom Layer w0.5: v1(61.71,55.35) 60.71,56.35 v1(60.21,56.35) ; 74LS189_1.7 88.35,53.15 v1(85.85,55.65) ; v1(68.71,53.51) v1(72.21,53.51) ; v1(37.21,53.85) v1(41.71,58.35)
$1N1974: length 73.4
  Top Layer w0.5: v1(48.29,62.95) 71.79,62.95 72.79,63.95 v1(75.79,63.95)
  Bottom Layer w0.5: 74LS04_1.5 28.29,52.35 29.79,50.85 35.29,50.85 43.29,58.85 43.29,60.95 44.29,61.95 47.29,61.95 v1(48.29,62.95) ; 74LS189_1.9 90.89,62.45 89.39,63.95 87.89,63.95 87.39,64.45 76.29,64.45 v1(75.79,63.95)
$1N1975: length 65.6
  Top Layer w0.5: v1(76.91,60.45) 76.91,61.35 77.41,61.85 77.41,64.77 77.33,64.85 72.33,64.85 71.33,63.85 v1(48.83,63.85) ; v1(40.33,59.35) 33.83,59.35 33.33,58.85 32.33,58.85 30.83,60.35 74LS04_1.9 ; 74LS189_1.11 84.31,58.95 82.91,58.95 v1(82.41,59.45)
  Bottom Layer w0.5: v1(48.83,63.85) 44.83,63.85 v1(40.33,59.35) ; v1(76.91,60.45) 76.91,59.95 77.91,58.95 81.91,58.95 v1(82.41,59.45)
$1N1976: length 73
  Top Layer w0.5: v1(27.25,55.35) 28.03,54.58 62.53,54.58 70.25,46.85 70.25,44.85 70.75,44.35 v1(70.75,41.35) ; 74LS189_2.5 83.2,36.35 82.7,36.35 80.7,38.35 v1(80.7,38.85)
  Bottom Layer w0.5: 74LS04_1.11 25.25,57.35 v1(27.25,55.35) ; v1(70.75,41.35) 71.75,40.35 73.25,40.35 74.75,38.85 v1(80.7,38.85)
$1N1977: length 85.2
  Top Layer w0.5: v1(67.75,52.27) 67.75,50.77 v1(69.25,49.27) ; v1(73.25,49.27) 75.25,47.27 75.25,45.77 74.25,44.77 74.25,43.77 v1(77.25,40.77) ; 74LS04_1.13 20.17,57.85 20.25,57.77 30.75,57.77 32.95,55.58 60.55,55.58 61.75,56.77 62.25,56.77 65.25,53.77 v1(66.75,53.77) ; v1(85.85,38.77) 74LS189_2.7
  Bottom Layer w0.5: v1(66.75,53.77) 66.75,53.27 v1(67.75,52.27) ; v1(85.85,38.77) 84.85,39.77 78.25,39.77 v1(77.25,40.77) ; v1(69.25,49.27) v1(73.25,49.27)
$1N1978: length 83.2
  Top Layer w0.5: v1(83.53,45.71) 82.53,45.71 82.03,45.21 v1(82.03,44.71) ; v1(59.63,46.11) 58.13,47.61 44.63,47.61 v1(42.63,45.61) ; v1(66.13,46.61) 66.63,46.61 v1(70.03,43.21) ; v1(22.13,37.61) 23.13,37.61 v1(28.13,42.61) ; v1(89.39,45.71) 74LS189_2.9
  Bottom Layer w0.5: v1(82.03,44.71) 82.03,43.71 81.03,42.71 72.53,42.71 72.03,43.21 v1(70.03,43.21) ; v1(28.13,42.61) 39.13,42.61 42.13,45.61 v1(42.63,45.61) ; v1(59.63,46.11) 65.63,46.11 v1(66.13,46.61) ; v1(83.53,45.71) v1(89.39,45.71) ; 74LS04_2.1 19.13,37.61 v1(22.13,37.61)
$1N1979: length 71.3
  Top Layer w0.5: v1(42.31,39.21) 43.81,39.21 v1(44.81,40.21) ; v1(38.31,41.21) 27.81,41.21 74LS04_2.3 ; v1(47.31,39.71) 52.31,39.71 53.31,40.71 v1(55.31,40.71) ; v1(63.31,42.21) v1(65.31,40.21)
  Bottom Layer w0.5: v1(55.31,40.71) 56.81,42.21 v1(63.31,42.21) ; v1(42.31,39.21) 41.81,38.71 40.31,38.71 38.31,40.71 v1(38.31,41.21) ; 74LS189_2.11 83.31,41.71 72.31,41.71 71.81,42.21 68.81,42.21 66.81,40.21 v1(65.31,40.21) ; v1(44.81,40.21) 46.81,40.21 v1(47.31,39.71)
$1N1980: length 99.9
  Top Layer w0.5: v1(47.37,29.65) 47.87,30.15 62.41,30.15 74LS245.2
  Bottom Layer w0.5: v1(47.37,29.65) 46.87,30.15 43.87,30.15 33.87,40.15 26.87,40.15 23.87,43.15 23.87,54.65 20.17,58.35 ; 20.17,58.35 74LS04_1.2 ; 20.17,58.35 18.87,59.65 R1.1
$1N1981: length 176.3
  Top Layer w0.5: v1(26.41,43.01) 23.41,40.01 v1(19.91,40.01) ; v1(17.91,39.51) 18.91,38.51 18.91,35.01 17.41,33.51 v1(16.41,33.51) ; v1(14.91,31.01) 14.91,28.01 11.91,25.01 v1(11.91,17.51) ; v1(39.41,16.01) 37.91,16.01 36.41,17.51 v1(32.41,17.51) ; v1(52.41,12.01) 49.91,12.01 v1(48.41,10.51) ; v1(69.41,15.51) 71.91,18.01 80.14,18.01 v1(80.64,18.51) ; v1(61.91,14.01) 60.91,13.01 v1(54.91,13.01) ; v1(22.41,14.01) v1(25.41,14.01)
  Bottom Layer w0.5: 29.91,56.51 29.25,55.85 ; 29.91,56.51 27.41,59.01 26.91,59.01 26.41,59.51 26.41,63.51 21.41,68.51 21.41,71.4 28.41,78.4 29.91,78.4 R2.1 ; 29.91,56.51 30.57,55.85 ; 29.25,55.85 26.41,53.01 v1(26.41,43.01) ; 29.25,55.85 28.75,55.85 74LS04_1.4 ; 29.25,55.85 30.57,55.85 ; 30.57,55.85 31.25,55.85 ; 74LS245.3 76.59,18.51 v1(80.64,18.51) ; v1(14.91,31.01) 16.41,32.51 v1(16.41,33.51) ; v1(22.41,14.01) 18.91,17.51 v1(11.91,17.51) ; v1(32.41,17.51) 28.41,17.51 25.41,14.51 v1(25.41,14.01) ; v1(39.41,16.01) 40.41,16.01 43.91,12.51 46.41,12.51 v1(48.41,10.51) ; v1(52.41,12.01) 53.91,12.01 v1(54.91,13.01) ; v1(17.91,39.51) 18.41,40.01 v1(19.91,40.01) ; v1(69.41,15.51) 67.91,14.01 v1(61.91,14.01)
$1N1982: length 99.5
  Top Layer w0.5: v1(37.83,45.85) 34.33,49.35 v1(34.33,52.35) ; 74LS245.4 77.18,23 73.33,26.85 v1(73.33,27.85) ; v1(40.83,67.35) v1(43.95,70.47) ; v1(68.83,30.85) 67.33,32.35 v1(61.83,32.35) ; v1(56.33,34.35) 55.83,34.85 v1(52.33,34.85)
  Bottom Layer w0.5: v1(68.83,30.85) 71.33,30.85 73.33,28.85 v1(73.33,27.85) ; v1(61.83,32.35) 61.33,32.85 57.83,32.85 v1(56.33,34.35) ; v1(34.33,52.35) 34.33,53.85 32.83,55.35 ; v1(37.83,45.85) 41.33,45.85 41.83,46.35 44.33,46.35 45.83,44.85 45.83,43.35 48.33,40.85 48.33,35.35 49.33,34.35 51.83,34.35 v1(52.33,34.85) ; v1(40.83,67.35) 40.83,62.85 34.33,56.35 33.83,56.35 32.83,55.35 ; 32.83,55.35 30.33,52.85 74LS04_1.6 ; v1(43.95,70.47) R3.1
$1N1983: length 108.8
  Top Layer w0.5: v1(35.37,52.35) 35.37,49.35 v1(37.87,46.85) ; v1(39.87,67.85) v1(41.87,69.85) ; 74LS245.5 79.72,23.5 75.87,27.35 75.87,28.85 75.37,29.35 71.37,29.35 62.37,38.35 58.87,38.35 54.87,42.35 54.37,42.35 53.37,43.35 53.37,44.85 v1(52.37,45.85) ; v1(34.87,58.35) v1(37.87,58.35)
  Bottom Layer w0.5: 33.37,60.85 39.87,67.35 v1(39.87,67.85) ; 33.37,60.85 74LS04_1.8 ; 33.37,60.85 33.37,59.85 v1(34.87,58.35) ; v1(37.87,58.35) 35.37,55.85 v1(35.37,52.35) ; v1(37.87,46.85) 41.37,46.85 41.87,47.35 50.87,47.35 v1(52.37,45.85) ; R4.1 55.04,78.35 52.87,78.35 43.87,69.35 42.37,69.35 v1(41.87,69.85)
$1N1984: length 144.8
  Top Layer w0.5: v1(39.29,68.35) v1(41.29,70.35) ; v1(88.71,32.4) 88.71,34.4 89.71,35.4 89.71,38.4 v1(88.21,39.9) ; v1(87.21,62.4) 82.71,66.9 82.71,69.4 84.21,70.9 85.21,70.9 88.45,74.13 88.45,78.66 86.71,80.4 72.71,80.4 R5.1 67.76,78.35 47.79,78.35 v1(42.79,73.35)
  Bottom Layer w0.5: v1(87.21,62.4) 87.71,61.9 88.71,61.9 89.71,60.9 89.71,54.9 90.21,54.4 90.21,53.9 89.71,53.4 89.71,46.4 90.21,45.9 90.21,45.4 89.71,44.9 89.71,41.4 v1(88.21,39.9) ; v1(88.71,32.4) 91.21,29.9 91.21,27.41 85.71,21.91 83.71,21.91 74LS245.6 ; 74LS04_1.10 33.79,66.35 37.29,66.35 v1(39.29,68.35) ; v1(42.79,73.35) 41.29,71.85 v1(41.29,70.35)
$1N1985: length 142.6
  Top Layer w0.5: v1(84.07,69.4) 84.07,66.9 89.57,61.4 89.57,57.4 v1(92.57,54.4) ; v1(89.57,24.72) 91.07,26.22 v1(91.07,34.4)
  Bottom Layer w0.5: v1(91.07,34.4) 93.57,36.9 93.57,45.9 92.57,46.9 v1(92.57,54.4) ; 74LS245.7 85.3,20.46 v1(89.57,24.72) ; 74LS04_1.12 20.71,62.35 20.71,71.85 28.21,79.35 79.11,79.35 R6.1 81.57,71.9 v1(84.07,69.4)
$1N1986: length 150.3
  Top Layer w0.5: v1(58.17,15.61) 58.17,19.11 57.17,20.11 57.17,22.11 v1(55.17,24.11) ; v1(86.34,19.96) 86.84,20.46 74LS245.8 v1(83.5,16.61) ; v1(101.34,46.46) 100.34,47.46 100.34,49.46 102.34,51.46 102.34,60.96 94.11,69.19 R7.1 ; v1(95.84,38.46) 95.84,37.96 95.34,37.46 v1(95.34,34.96)
  Bottom Layer w0.5: v1(95.34,34.96) 95.34,28.96 v1(86.34,19.96) ; v1(101.34,46.46) 95.84,40.96 v1(95.84,38.46) ; v1(83.5,16.61) 67.17,16.61 65.67,15.11 58.67,15.11 v1(58.17,15.61) ; v1(55.17,24.11) 46.17,24.11 44.17,26.11 40.17,26.11 38.17,28.11 37.17,28.11 33.67,31.61 24.67,31.61 74LS04_2.2
$1N1987: length 147.7
  Top Layer w0.5: v1(28.75,25.61) 27.75,25.61 25.75,27.61 25.75,35.61 74LS04_2.4 ; R8.1 106.65,64.4 110.1,60.96 110.1,50.96 v1(108.6,49.46) ; v1(30.75,23.11) 30.75,20.11 31.75,19.11 39.75,19.11 40.75,18.11 v1(57.25,18.11)
  Bottom Layer w0.5: 89.6,20.46 74LS245.9 ; 89.6,20.46 89.1,20.46 86.25,17.61 59.75,17.61 59.25,18.11 v1(57.25,18.11) ; 89.6,20.46 103.1,33.96 105.1,33.96 105.6,34.46 105.6,46.46 v1(108.6,49.46) ; v1(30.75,23.11) 28.75,25.11 v1(28.75,25.61)
$1N1989: length 10.1
  Bottom Layer w0.5: LED1.1 22.68,70.55 R1.2
$1N1990: length 10.1
  Bottom Layer w0.5: R8.2 110.46,70.55 LED8.1
$1N1991: length 10.1
  Bottom Layer w0.5: R7.2 97.92,70.55 LED7.1
$1N1992: length 10.1
  Top Layer w0.5: R6.2 91.73,75.81 LED6.1
$1N1993: length 10.1
  Top Layer w0.5: LED5.1 72.84,70.36 R5.2
$1N1994: length 10.1
  Bottom Layer w0.5: R4.2 60.3,70.55 LED4.1
$1N1995: length 10.1
  Bottom Layer w0.5: LED3.1 47.76,70.55 R3.2
$1N1996: length 10.1
  Bottom Layer w0.5: R2.2 35.22,70.55 LED2.1
$1N2010: length 55.7
  Top Layer w0.5: v1(93.71,51.01) 93.14,50.43 85.64,50.43 85.21,50.01 ; v1(78.71,40.51) 78.71,36.79 74LS189_2.3 ; 85.21,50.01 87.21,48.01 87.21,43.01 84.71,40.51 v1(83.71,40.51) ; 85.21,50.01 84.21,51.01 79.69,51.01 74LS189_1.3
  Bottom Layer w0.5: 74LS157_2.4 107.21,54.2 96.91,54.2 v1(93.71,51.01) ; v1(83.71,40.51) v1(78.71,40.51)
$1N2047: length 15.3
  Bottom Layer w0.5: 103.63,20.83 101.13,18.33 101.13,8.56 Button.3
$1N2048: length 16
  Top Layer w0.5: 74LS157_1.3 106.17,26.37 107.41,27.61 107.41,35.61 74LS00.3
$1N2052: length 102.6
  Top Layer w0.5: v1(79.49,10.76) 94.99,10.76 102.33,18.11 102.33,35.61 74LS00.1
  Bottom Layer w0.5: R0.2 27.25,13.26 10nF.1 33.61,13.26 41.61,5.26 73.99,5.26 v1(79.49,10.76)
$1N3924: length 42.6
  Top Layer w0.5: 103.63,52.7 108.21,48.12 108.21,41.83 113.21,36.83 113.21,33.83 117.71,29.33 117.71,27.83 116.71,26.83 114.71,26.83 74LS157_1.4
$1N5081: length 36.9
  Bottom Layer w0.5: 74LS189_1.4 80.73,51.51 77.69,48.47 68.69,48.47 67.69,47.47 67.69,45.47 63.69,41.47 57.19,41.47 74LS157_5.4
$1N5090: length 36.4
  Top Layer w0.5: 74LS157_3.4 23.51,21.83 23.51,24.83 24.51,25.83 26.51,25.83 27.51,24.83 30.51,24.83 33.51,27.83 33.51,30.33 39.65,36.47 v1(42.15,36.47)
  Bottom Layer w0.5: v1(42.15,36.47) 43.65,37.97 45.61,37.97 74LS157_5.2
$1N5094: length 32.7
  Bottom Layer w0.5: 74LS157_5.7 69.31,45.97 73.31,45.97 74.81,47.47 77.81,47.47 81.31,50.97 83.81,50.97 85.35,52.51 74LS189_1.6
$1N5107: length 36.2
  Bottom Layer w0.5: 74LS157_5.9 64.85,44.09 66.85,46.09 66.85,48.09 68.85,50.09 78.35,50.09 79.35,51.09 79.35,52.95 81.85,55.45 81.85,57.45 83.35,58.95 86.85,58.95 74LS189_1.10
$1N5122: length 38.9
  Top Layer w0.5: v1(76.23,61.95) 72.73,61.95 71.23,60.45 71.23,60.09 v1(67.73,56.59) ; v1(64.73,55.59) 65.23,55.09 v1(66.73,55.09)
  Bottom Layer w0.5: v1(76.23,61.95) 81.77,61.95 74LS189_1.12 ; v1(66.73,55.09) 66.73,55.59 v1(67.73,56.59) ; v1(64.73,55.59) 64.73,53.09 57.23,45.59 56.23,45.59 74LS157_5.12
$1N5139: length 41.8
  Top Layer w0.5: v1(82.29,34.72) 74LS189_2.4 ; v1(63.3,22.33) v1(63.3,25.33)
  Bottom Layer w0.5: v1(63.3,22.33) 52.3,22.33 74LS157_6.4 ; v1(63.3,25.33) 63.3,26.33 70.8,33.83 81.4,33.83 v1(82.29,34.72)
$1N5152: length 35.9
  Bottom Layer w0.5: 74LS189_2.6 78.37,28.83 78.37,27.33 77.87,26.83 71.42,26.83 63.92,19.33 60.42,19.33 58.92,20.83 74LS157_6.7
$1N5161: length 45.5
  Top Layer w0.5: v1(60.31,26.2) 60.81,26.2 v1(61.81,27.2) ; v1(67.81,39.2) 67.81,35.7 v1(68.31,35.2) ; 74LS157_6.5 53.81,21.3 53.81,23.8 55.81,25.8 v1(56.81,25.8) ; v1(69.31,41.2) 59.81,50.7 74LS157_4.7
  Bottom Layer w0.5: v1(61.81,27.2) 68.31,33.7 v1(68.31,35.2) ; v1(60.31,26.2) 57.21,26.2 v1(56.81,25.8) ; v1(69.31,41.2) 69.31,40.7 v1(67.81,39.2)
$1N5165: length 52.6
  Top Layer w0.5: v1(81.96,24.95) 80.96,25.95 80.96,28.95 v1(81.46,29.45) ; v1(67.96,20.45) 65.46,22.95 65.46,24.95 61.96,28.45 74LS157_6.9 ; 74LS189_2.10 88.35,42.85 84.46,38.95 84.46,34.45 v1(84.96,33.95)
  Bottom Layer w0.5: v1(81.96,24.95) 80.46,23.45 75.96,23.45 73.46,20.95 73.46,19.95 72.46,18.95 68.96,18.95 67.96,19.95 v1(67.96,20.45) ; v1(84.96,33.95) 81.46,30.45 v1(81.46,29.45)
$1N5176: length 42.4
  Top Layer w0.5: v1(65.85,41.33) 66.35,40.83 66.35,38.33 65.35,37.33 v1(64.75,37.33) ; v1(63.85,58.33) 64.35,58.33 v1(65.85,56.83) ; v1(63.75,35.83) 59.25,31.33 v1(58.75,31.33) ; v1(64.85,46.83) v1(68.35,43.33)
  Bottom Layer w0.5: v1(65.85,41.33) 67.85,43.33 v1(68.35,43.33) ; 74LS157_4.9 62.35,59.83 v1(63.85,58.33) ; v1(58.75,31.33) 74LS157_6.11 ; v1(65.85,56.83) 65.85,52.83 64.35,51.33 64.35,47.33 v1(64.85,46.83) ; v1(64.75,37.33) 64.75,36.83 v1(63.75,35.83)
$1N5180: length 42.6
  Top Layer w0.5: v1(82.51,37.95) 82.51,43.45 74LS189_2.12
  Bottom Layer w0.5: 74LS157_6.12 53.84,28.45 55.34,26.95 60.84,26.95 61.48,26.3 62.19,26.3 70.84,34.95 81.51,34.95 82.01,35.45 82.01,37.45 v1(82.51,37.95)
$1N5191: length 46.3
  Top Layer w0.5: v1(43.26,41.85) 41.76,43.35 41.76,46.85 v1(43.26,48.35)
  Bottom Layer w0.5: 74LS157_4.12 52.23,57.83 47.23,57.83 43.26,53.85 v1(43.26,48.35) ; 74LS157_6.14 48.26,29.95 47.26,30.95 44.26,30.95 41.26,33.95 41.26,36.85 43.26,38.85 v1(43.26,41.85)
